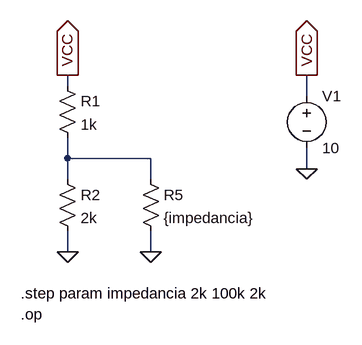
[diagram p0: schematic Alta Impedancia.asc]
Alta Impedancia.asc, the LTspice schematic file:
Version 4
SHEET 1 1096 680
WIRE 656 16 656 0
WIRE 1024 32 1024 0
WIRE 656 128 656 96
WIRE 784 128 656 128
WIRE 1024 144 1024 112
WIRE 656 160 656 128
WIRE 784 160 784 128
WIRE 656 272 656 240
WIRE 784 272 784 240
FLAG 1024 144 0
FLAG 1024 0 VCC
IOPIN 1024 0 Out
FLAG 656 0 VCC
IOPIN 656 0 Out
FLAG 656 272 0
FLAG 784 272 0
SYMBOL voltage 1024 16 R0
SYMATTR InstName V1
SYMATTR Value 10
SYMBOL res 640 0 R0
SYMATTR InstName R1
SYMATTR Value 1k
SYMBOL res 640 144 R0
SYMATTR InstName R2
SYMATTR Value 2k
SYMBOL res 768 144 R0
SYMATTR InstName R5
SYMATTR Value {impedancia}
TEXT 584 336 Left 2 !.step param impedancia 2k 100k 2k
TEXT 584 368 Left 2 !.op

The netlist it stands for:
* Alta Impedancia.asc
V1 VCC 0 10
R1 VCC N001 1k
R2 N001 0 2k
R5 N001 0 {impedancia}
.step param impedancia 2k 100k 2k
.op
.backanno
.end